# EAGLE design pd15 (EAGLE 6.5.0)
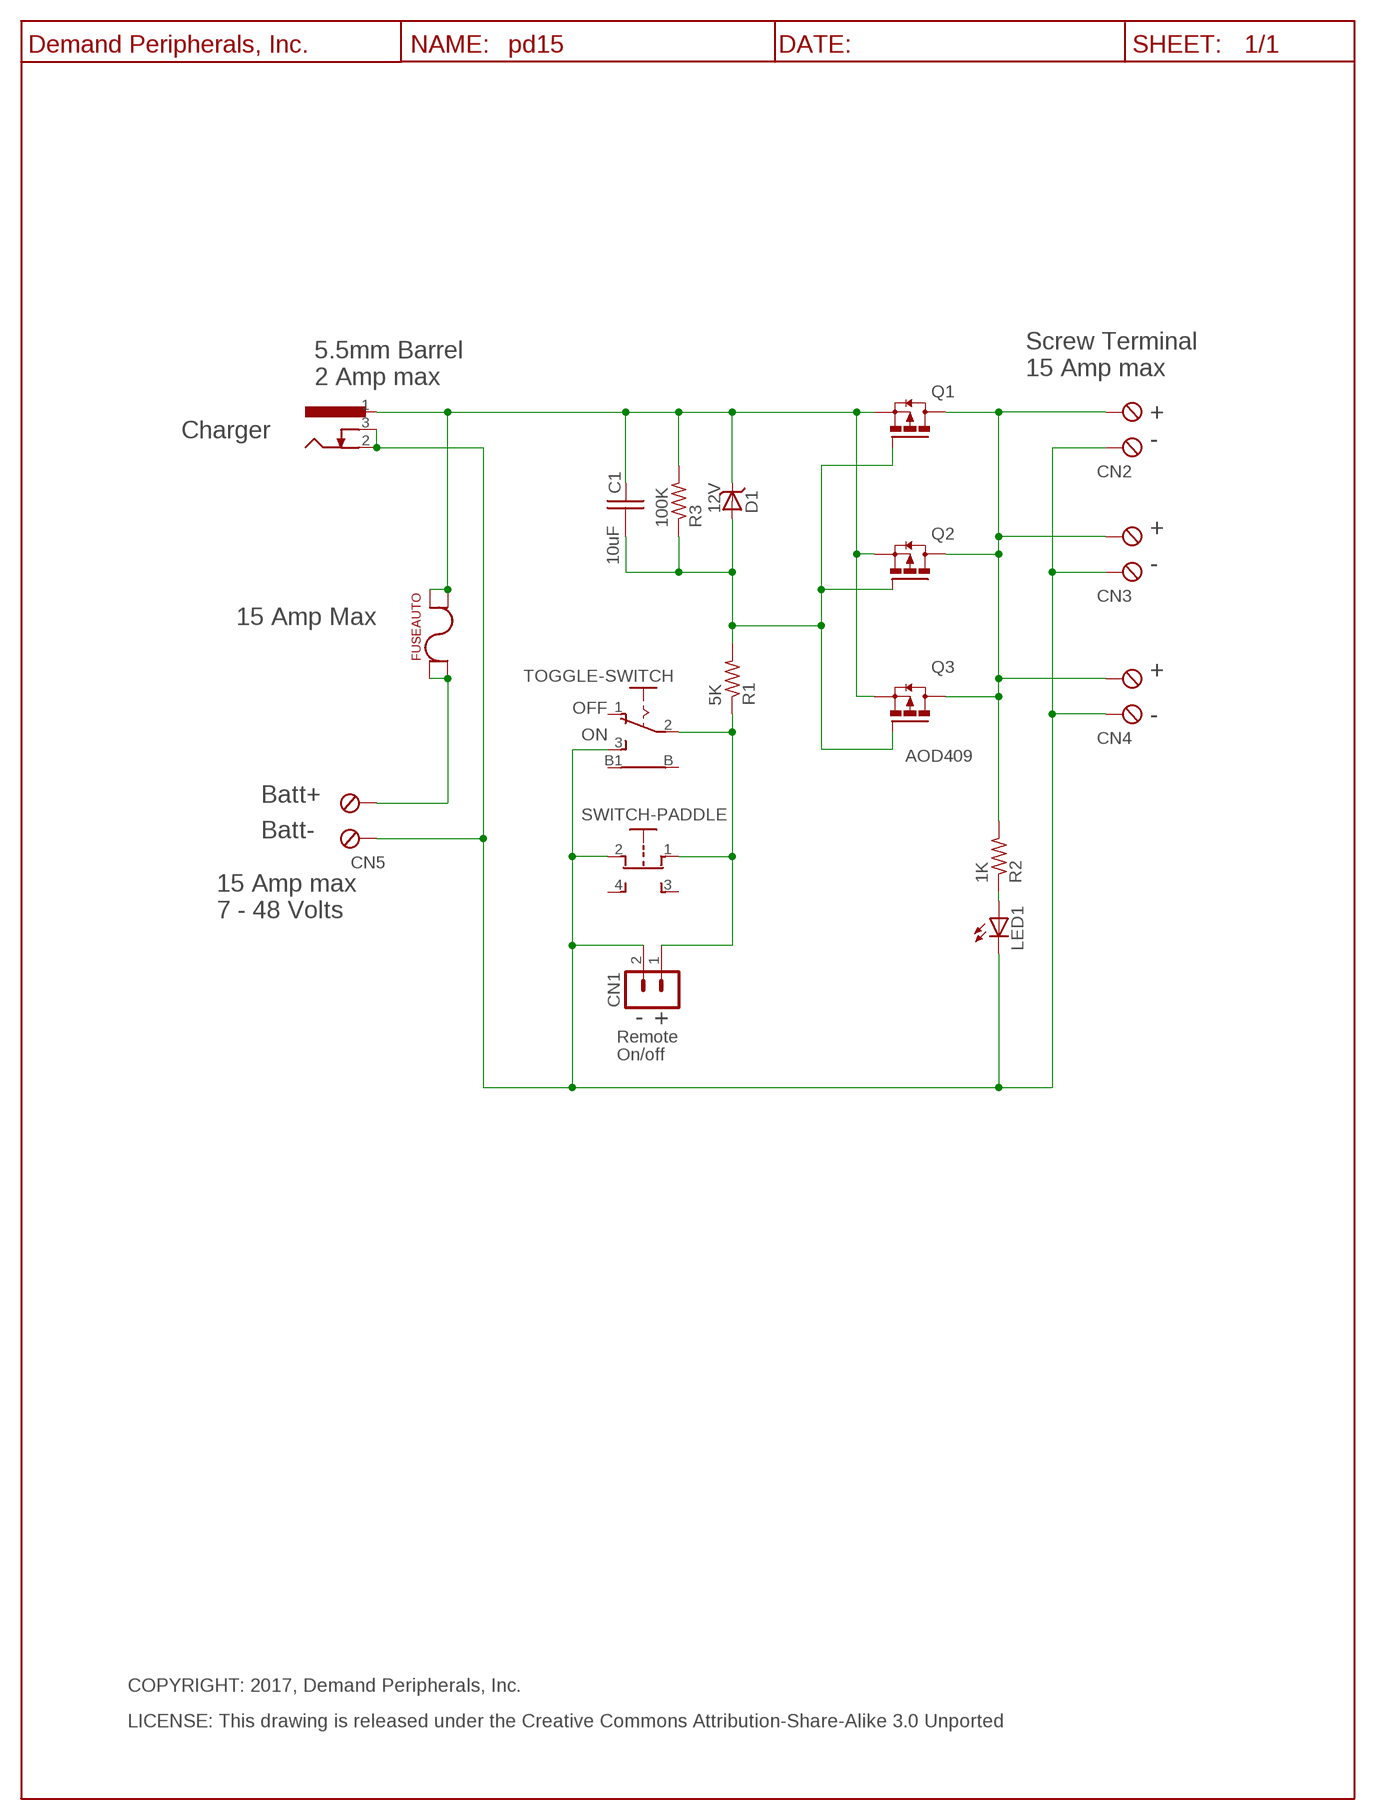
[diagram p0: schematic, sheet 1]

## Parts
C1  10uF  C10UF35V_C0805  [C0805]
CN1  HDR-2X1-LCK  [HDR-2X1]
CN2  TBLK-5.08-X2  [TBLK-5.08-X2]
CN3  TBLK-5.08-X2  [TBLK-5.08-X2]
CN4  TBLK-5.08-X2  [TBLK-5.08-X2]
CN5  TBLK-5.08-X2  [TBLK-5.08-X2]
D1  12V  BZT52C12  [SOD123]
FUSE  FUSEAUTO  FUSE-KS3557  [KS3557-10]
J1  Barrel-5.5mm  DC-BARREL-JACK--55MM  [DC-BARREL-JACK-55MM]
LED1  LED-5MM-GRN  [LED5MM]
Q1  FET_DPAK_P  AOD409  [DPACK_TO-252]
Q2  FET_DPAK_P  AOD409  [DPACK_TO-252]
Q3  AOD409  [DPACK_TO-252]
R1  5K  R4.99K_R0603  [R0603]
R2  1K  R1K_R0603  [R0603]
R3  100K  R100K_R0603  [R0603]
SW2  SWITCH-PADDLE  [SWITCH-PADDLE]
TOGGLE-SWITCH  B12EH  TOGGLE_SPDT_PC  [TOGGLE_SPDT_PC]
U$1  DP_FRAME_P  [LETTER_P]

## Nets
BATT+: CN5.2(KL1) FUSE.LS@1(LS) FUSE.LS@2(LS)
FUSE+: C1.1 D1.C FUSE.RS@3(RS) FUSE.RS@4(RS) J1.1 Q1.3(S) Q2.3(S) Q3.3(S) R3.2
GND: CN1.2 CN2.1(KL) CN3.1(KL) CN4.1(KL) CN5.1(KL) J1.2 J1.3 LED1.C SW2.2 TOGGLE-SWITCH.3(S)
N$1: LED1.A R2.1
N$10: C1.2 D1.A Q1.1(G) Q2.1(G) Q3.1(G) R1.2 R3.1
ON+: CN1.1 R1.1 SW2.1 TOGGLE-SWITCH.2(P)
V+: CN2.2(KL1) CN3.2(KL1) CN4.2(KL1) Q1.4(D) Q2.4(D) Q3.4(D) R2.2
Unconnected: SW2.3 SW2.4 TOGGLE-SWITCH.1(O) TOGGLE-SWITCH.B TOGGLE-SWITCH.B1

## Notes on the sheet
- Screw Terminal
- 5.5mm Barrel
- 15 Amp max
- 2 Amp max
- +
- Charger
- -
- +
- -
- 15 Amp Max
- +
- OFF
- -
- ON
- Batt+
- Batt-
- 15 Amp max
- 7 - 48 Volts
- - | +
- Remote
- On/off
- COPYRIGHT: 2017, Demand Peripherals, Inc.
- LICENSE: This drawing is released under the Creative Commons Attribution-Share-Alike 3.0 Unported

## Library data of the parts
C1 = dpi-passive:C10UF35V_: 10 uF Capacitor, 35V, X6S; VENDOR: Digikey; VENDOR-PART-NUM: 490-10504-2-ND
CN1 = dpi-conn:HDR-2X1-LCK: 2x1 pin header with friction lock; VENDOR: Mouser; VENDOR-PART-NUM: 571-6404562
CN2-CN5 = dpi-conn:TBLK-5.08-X2: Terminal Block, 5.08mm, x2, screw terminals; VENDOR: Digikey; VENDOR-PART-NUM: ED2609-ND
D1 = dpi-diopto:BZT52C12: BZT52C12 12 volt Zener, 500 mW; VENDOR: Digikey; VENDOR-PART-NUM: BZT52C1213-FDICT-ND
FUSE = dpi-conn:FUSE-KS3557: Automotive fuse holder; VENDOR: Digikey; VENDOR-PART-NUM: 36-3557-10-ND
J1 = dpi-conn:DC-BARREL-JACK--55MM: 5.5 mm DC POWER JACK, CUI PJ-102AH; VENDOR: Digikey; VENDOR-PART-NUM: CP-102AH-ND
LED1 = dpi-diopto:LED-5MM-GRN: Green LED, 5 MM, through-hole; VENDOR: Digikey; VENDOR-PART-NUM: 160-1852-ND
Q1-Q3 = dpi-transic:AOD409: FET P-channel D-PAK w/diode; VENDOR: Digikey; VENDOR-PART-NUM: 785-1103-1-ND
R1 = dpi-passive:R4.99K_: 4.99K Resistor, 1%, 0.1 watt; VENDOR: Digikey; VENDOR-PART-NUM: 311-4.99KHRTR-ND
R2 = dpi-passive:R1K_: 1K Resistor, 1%, 0.1 watt; VENDOR: Digikey; VENDOR-PART-NUM: 311-1.00KHRTR-ND
R3 = dpi-passive:R100K_: 100K Resistor, 1%, 0.1 watt; VENDOR: Digikey; VENDOR-PART-NUM: 311-100KHRTR-ND
SW2 = dpi-swsens:SWITCH-PADDLE: DPI Paddle Switch; VENDOR: DPI; VENDOR-PART-NUM: DPI-paddle-switch
TOGGLE-SWITCH = dpi-swsens:TOGGLE_SPDT_PC: SPDT TOGGLE SWITCH; VENDOR: Digikey; VENDOR-PART-NUM: CKN1454-ND
U$1 = DP:DP_FRAME_P: Portrait/Letter Document Frame

## Board
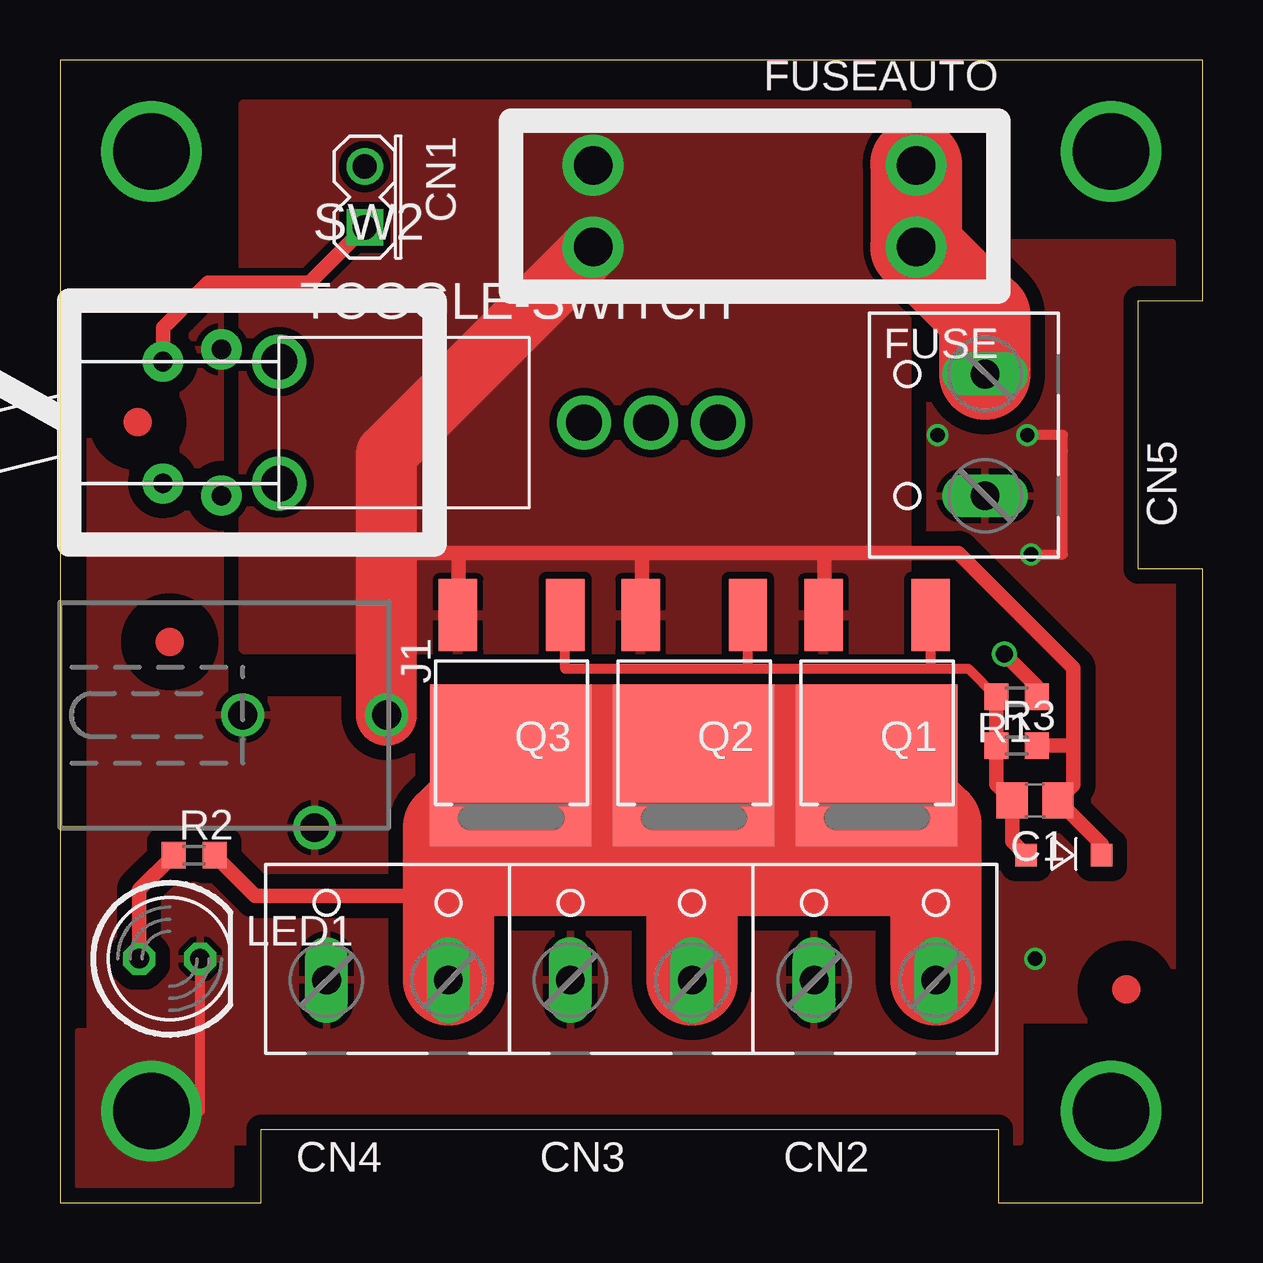
[diagram p1: board, top side]
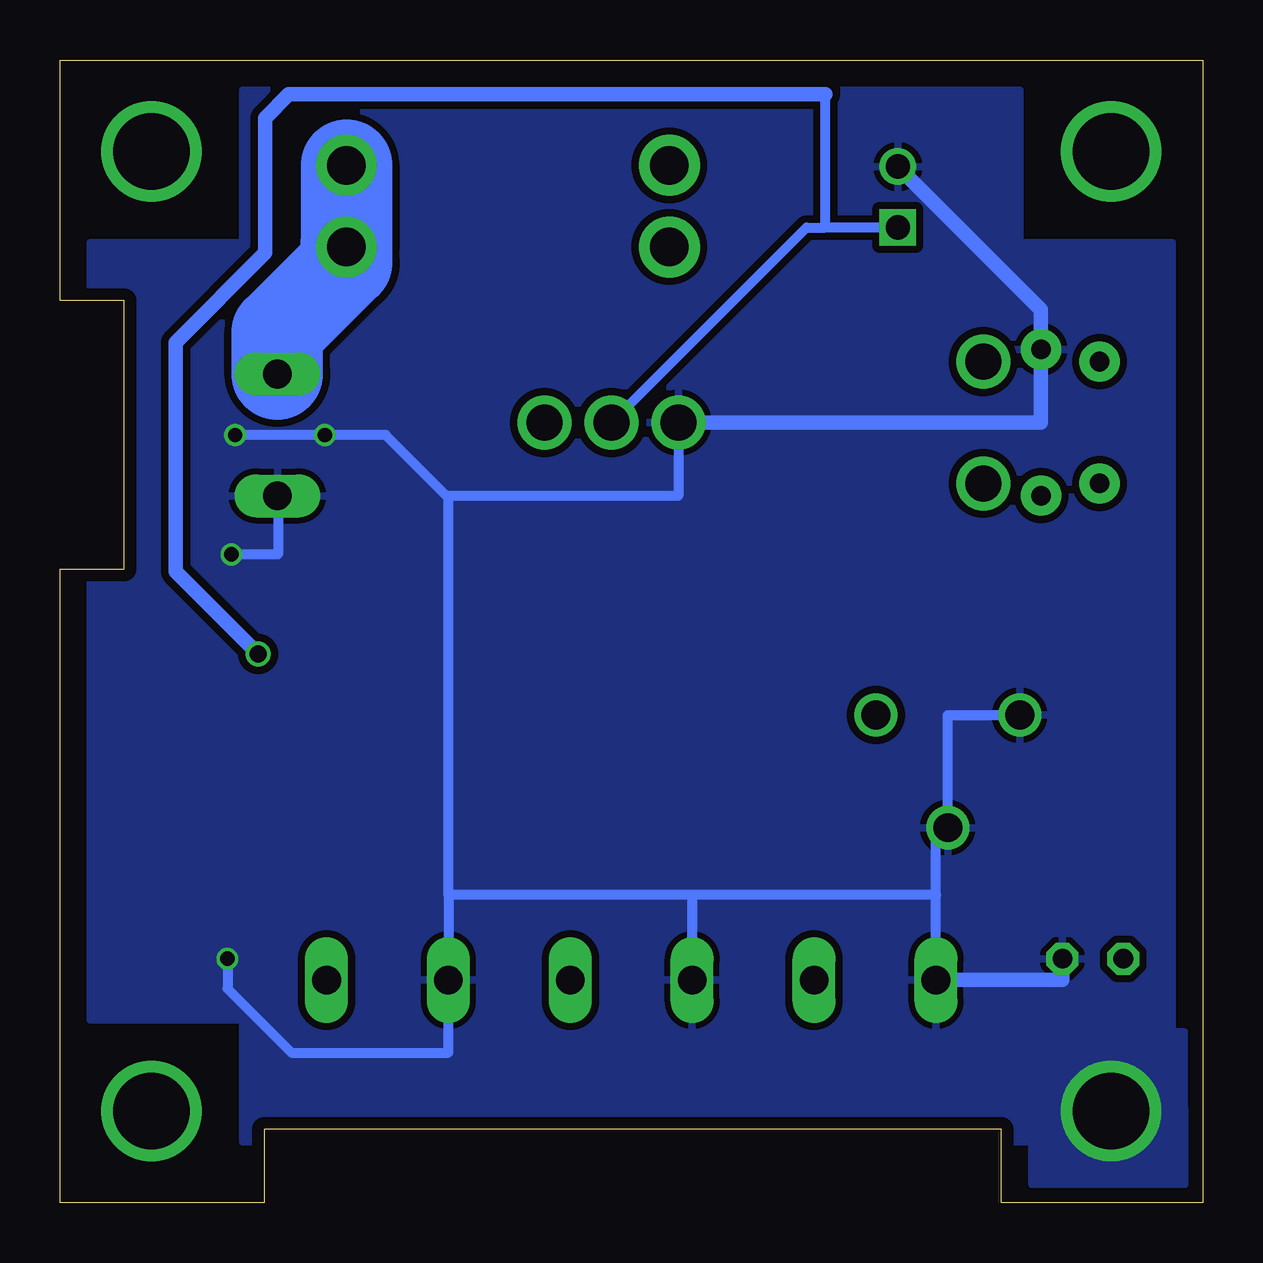
[diagram p2: board, bottom side, seen from below]

Size 47.62 x 47.62 mm. Coordinates in mm from the lower left corner, seen from the top.
Outline: 0,0 8.38,0 8.38,3.05 39.12,3.05 39.12,0 47.62,0 47.62,26.42 44.96,26.42 44.96,37.59 47.62,37.59 47.62,47.62 0,47.62 0,0
Copper layers (1*16): Top 0.035mm / dielectric 1.5mm / Bottom 0.035mm
Design rules "Fusion_eagle_rule_v1.1 *": minimum track width 6mil, minimum drill 12mil, track to track 12mil, track to pad 12mil, pad to pad 12mil, via to via 12mil, smd to smd 0mil, copper to edge 20mil, drill to drill 10mil, minimum pad ring 10mil, minimum via ring 6mil, stop-mask expansion 2mil, vias tented up to drill 10mil, thermal gap 10mil

### Footprints (pad centres in the part's own frame; a part is rotated, then mirrored left to right if it is on the bottom)
C0805 = smd 1.3 x 1.5: 1 -0.95,0; 2 0.95,0
HDR-2X1 = drill 1.016 square: 1 1.27,0 | drill 1.016: 2 -1.27,0
TBLK-5.08-X2 = drill 1.194 long: 1 -2.54,-0.127; 2 2.54,-0.127
SOD123 = smd 0.9 x 0.95: A 1.575,0; C -1.575,0
KS3557-10 = drill 1.6 pad 2.54: LS@1 -6.731,-1.702; LS@2 -6.731,1.702; RS@3 6.731,1.702; RS@4 6.731,-1.702
DC-BARREL-JACK-55MM = drill 1.2: 1 0,5.994; 2 0,0; 3 4.699,2.997
LED5MM = drill 0.813 octagon: A -1.27,0; C 1.27,0
DPACK_TO-252 = smd 1.6 x 2.997: 1 -2.261,-4.928; 3 2.21,-4.928 | smd 6.731 x 6.731: 4 0,1.321
R0603 = smd 1 x 1.1: 1 -0.85,0; 2 0.85,0
SWITCH-PADDLE = drill 0.813 pad 1.676: 1 -2.438,2.54; 2 0,3.048; 3 -2.438,-2.54; 4 0,-3.048
TOGGLE_SPDT_PC = drill 1.5 pad 1.676: 1 18.288,0; 2 15.494,0; 3 12.7,0 | drill 1.5 pad 1.778: B 0,-2.54; B1 0,2.54

### Placement (x,y rotation side)
C1  40.64,16.76 180 top
CN1  12.7,41.91 270 top
CN2  33.97,9.4 0 top
CN3  23.81,9.4 0 top
CN4  13.65,9.4 0 top
CN5  38.43,31.99 90 top
D1  41.85,14.48 180 top
FUSE  28.96,41.53 180 top
J1  7.62,20.32 270 top
LED1  4.57,10.16 0 top
Q1  34.04,19.56 180 top
Q2  26.42,19.56 180 top
Q3  18.8,19.56 180 top
R1  39.88,21.08 180 top
R2  5.59,14.48 0 top
R3  39.88,19.05 0 top
SW2  6.73,32.51 0 top
TOGGLE-SWITCH  9.14,32.51 0 top
U$1  -2.54,-2.54 0 top
U$3  [FIDUCIAL]  3.24,32.54 180 top
U$4  [FIDUCIAL]  4.57,23.37 180 top
U$8  [DPI-2]  17.2,42.43 0 bottom
U$12  [FIDUCIAL]  44.45,8.89 180 top

### Tracks (layer width: path | path; a pad name or v marks a point on that pad's centre or on a via)
BATT+
  Top 3.81: CN5.2 38.56,36.96 FUSE.LS@2
  Bottom 3.81: FUSE.LS@1 FUSE.LS@2
FUSE+
  Top 0.61: 31.86,27.08 32.51,27.08 37.44,27.08 42.24,22.28 42.24,18.99 | 31.86,27.08 31.83,27.08 24.26,27.08 | 24.26,27.08 16.62,27.08 | 16.62,27.08 13.61,27.08 | Q3.3 16.62,24.49 16.62,27.08 | Q2.3 24.26,24.49 24.26,27.08 | Q1.3 31.86,24.49 31.86,27.08 | 42.24,18.99 42.24,17.41 C1.1 43.42,14.93 D1.C | R3.2 42.18,19.05 42.24,18.99
  Top 2.54: J1.1 13.61,27.08 13.61,31.22 FUSE.RS@3
  pour Top: 7.65,45.77 7.65,23.08 35.31,23.08 35.31,45.77
GND  (via drill 0.6, 3.17)
  Top 0.406: v3.81,3.81 5.84,3.81 LED1.C | v40.48,27.01 41.81,27.01 41.81,31.34 41.81,31.99 v40.32,31.99
  Bottom 0.406: 31.51,29.45 31.43,29.45 31.43,12.81 | 31.43,12.81 CN2.1 31.43,6.25 37.97,6.25 40.64,8.91 v40.64,10.16 | CN4.1 11.11,12.81 | 21.27,12.81 31.43,12.81 | 21.27,12.81 CN3.1 | 11.11,12.81 21.27,12.81 | J1.2 10.62,20.32 J1.3 11.11,15.62 11.11,12.81 | TOGGLE-SWITCH.3 21.84,29.45 31.51,29.45 | 31.51,29.45 34.05,31.99 v36.59,31.99 38.53,31.99 v40.32,31.99 | 38.53,29.48 38.53,27.01 v40.48,27.01
  Bottom 0.61: LED1.C 5.84,9.27 CN4.1 | CN1.2 6.73,37.21 SW2.2 6.73,32.51 TOGGLE-SWITCH.3
  pour Top (isolate 0.61, rank 2): 1.27,7.11 1.27,40.01 6.86,40.01 6.86,20.95 35.81,20.95 35.81,40.01 46.35,40.01 46.35,7.62 40.01,7.62 40.01,2.54 7.11,2.54 7.11,0.76 0.76,0.75 0.76,7.11
  pour Bottom (isolate 0.305): 1.27,7.11 1.27,40.01 7.62,40.01 7.62,46.35 40.01,46.35 40.01,40.01 46.35,40.01 46.35,7.62 40.01,7.62 40.01,2.54 7.11,2.54 7.11,0.76 0.75,0.76 0.76,7.11
MOUNT  (via drill 3.17 pad 3.17)
  other vias: 43.81,43.81
N$1
  Top 0.61: R2.1 3.3,13.04 LED1.A
N$2
  Top 3.81: 35.7,39.8 35.7,43.26 35.67,43.28
N$3
  Bottom 3.81: 38.57,34.53 38.57,36.27 35.67,39.17 35.67,39.94 35.7,39.97
N$4  (via drill 3.17 pad 3.17)
  other vias: 3.81,43.81
N$5  (via drill 3.17 pad 3.17)
  other vias: 43.81,3.81
N$10
  Top 0.406: Q3.1 21.06,22.25 28.68,22.25 | 36.3,22.25 Q1.1 | 28.68,22.25 Q2.1 | 28.68,22.25 36.3,22.25 | 36.3,22.25 37.86,22.25 R1.2
  Top 0.61: D1.A 39.69,15.06 C1.2 39.03,17.43 R3.1 R1.2
ON+  (via drill 0.7)
  Top 0.61: SW2.1 4.29,36.46 4.9,37.07 6.17,38.34 7.62,38.34 10.4,38.34 CN1.1 | R1.1 40.73,21.5 v39.37,22.86
  Bottom 0.406: CN1.1 15.71,40.64 | 15.71,40.64 15.71,46.19 | TOGGLE-SWITCH.2 16.51,40.64 15.71,40.64
  Bottom 0.61: 15.71,46.19 18.25,46.19 38.09,46.19 39.08,45.2 39.08,39.59 42.81,35.85 42.81,28.6 42.81,26.3 v39.37,22.86
V+
  Top 0.61: R2.2 8.14,12.78 16.19,12.78
  Top 3.81: CN2.2 36.51,15.76 Q1.4 Q2.4 | CN3.2 26.35,18.17 Q2.4 | CN4.2 16.19,12.78 16.19,15.63 Q3.4 Q2.4
(copper drawn outside any net)
  shapes: Top area x1

### Text on the board
tTest: 1.575 Inches | 1.875 Inches | (C) 2017, Demand Peripherals, Inc. | Rmt On | Off | 15A Max | + | Rev 17A | PD15 | On | - | Q3 | Q2 | Q1 | R1 | Batt | R3 | C1 | R2 | 1.575 Inches | 1.875 Inches | LED | D1 | - | + | - | + | - | +